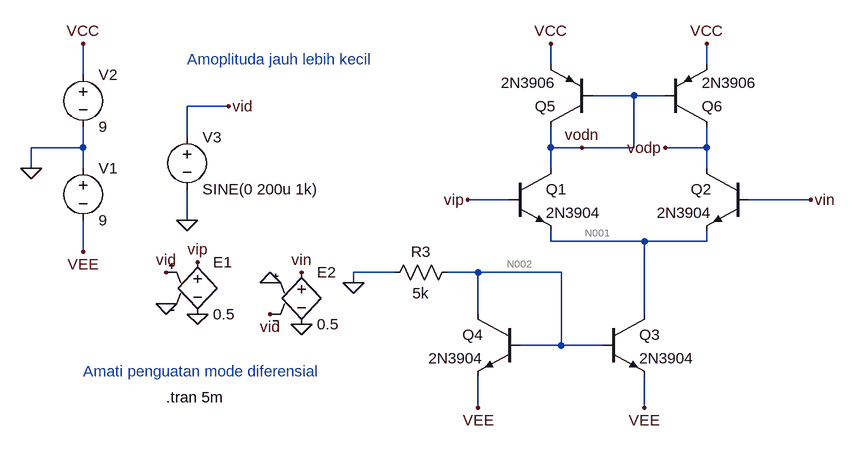
[diagram p0: schematic Perc-01-05-differentialmode.asc]
Perc-01-05-differentialmode.asc, the LTspice schematic file:
Version 4
SHEET 1 880 680
WIRE 400 -48 400 -80
WIRE 640 -48 640 -80
WIRE -320 -32 -320 -80
WIRE 528 0 464 0
WIRE 576 0 528 0
WIRE -96 16 -160 16
WIRE -160 64 -160 16
WIRE -320 80 -320 48
WIRE -320 80 -400 80
WIRE 400 80 400 48
WIRE 448 80 400 80
WIRE 528 80 528 0
WIRE 528 80 448 80
WIRE 640 80 640 48
WIRE 640 80 576 80
WIRE -400 112 -400 80
WIRE -320 112 -320 80
WIRE 400 112 400 80
WIRE 640 112 640 80
WIRE 336 160 272 160
WIRE 800 160 704 160
WIRE -160 192 -160 144
WIRE 400 224 400 208
WIRE 544 224 400 224
WIRE 640 224 640 208
WIRE 640 224 544 224
WIRE -320 240 -320 192
WIRE 160 272 96 272
WIRE 288 272 240 272
WIRE 416 272 288 272
WIRE 96 288 96 272
WIRE 288 336 288 272
WIRE 544 336 544 224
WIRE 416 384 416 272
WIRE 416 384 352 384
WIRE 480 384 416 384
WIRE 288 480 288 432
WIRE 544 480 544 432
FLAG 400 -80 VCC
FLAG 640 -80 VCC
FLAG 448 80 vodn
FLAG 576 80 vodp
FLAG -320 -80 VCC
FLAG -320 240 VEE
FLAG -400 112 0
FLAG -160 192 0
FLAG -96 16 vid
FLAG 96 288 0
FLAG 288 480 VEE
FLAG 544 480 VEE
FLAG 16 352 0
FLAG -144 336 0
FLAG -32 288 0
FLAG -192 320 0
FLAG -192 272 vid
FLAG -32 336 vid
FLAG 272 160 vip
FLAG 800 160 vin
FLAG 16 272 vin
FLAG -144 256 vip
SYMBOL npn 336 112 R0
SYMATTR InstName Q1
SYMATTR Value 2N3904
SYMBOL npn 704 112 M0
SYMATTR InstName Q2
SYMATTR Value 2N3904
SYMBOL voltage -320 96 R0
WINDOW 123 0 0 Left 0
WINDOW 39 0 0 Left 0
SYMATTR InstName V1
SYMATTR Value 9
SYMBOL voltage -320 -48 R0
WINDOW 123 0 0 Left 0
WINDOW 39 0 0 Left 0
SYMATTR InstName V2
SYMATTR Value 9
SYMBOL voltage -160 48 R0
WINDOW 123 0 0 Left 0
WINDOW 39 0 0 Left 0
SYMATTR InstName V3
SYMATTR Value SINE(0 200u 1k)
SYMBOL npn 480 336 R0
SYMATTR InstName Q3
SYMATTR Value 2N3904
SYMBOL npn 352 336 M0
SYMATTR InstName Q4
SYMATTR Value 2N3904
SYMBOL res 256 256 R90
WINDOW 0 0 56 VBottom 2
WINDOW 3 32 56 VTop 2
SYMATTR InstName R3
SYMATTR Value 5k
SYMBOL pnp 464 48 R180
SYMATTR InstName Q5
SYMATTR Value 2N3906
SYMBOL pnp 576 48 M180
SYMATTR InstName Q6
SYMATTR Value 2N3906
SYMBOL e -144 240 R0
SYMATTR InstName E1
SYMATTR Value 0.5
SYMBOL e 16 256 R0
SYMATTR InstName E2
SYMATTR Value 0.5
TEXT -192 464 Left 2 !.tran 5m
TEXT -320 424 Left 2 ;Amati penguatan mode diferensial
TEXT -160 -56 Left 2 ;Amoplituda jauh lebih kecil

The netlist it stands for:
* Perc-01-05-differentialmode.asc
Q1 vodn vip N001 0 2N3904
Q2 vodp vin N001 0 2N3904
V1 0 VEE 9
V2 VCC 0 9
V3 vid 0 SINE(0 200u 1k)
Q3 N001 N002 VEE 0 2N3904
Q4 N002 N002 VEE 0 2N3904
R3 N002 0 5k
Q5 vodn vodn VCC 0 2N3906
Q6 vodp vodn VCC 0 2N3906
E1 vip 0 vid 0 0.5
E2 vin 0 0 vid 0.5
.model NPN NPN
.model PNP PNP
.lib standard.bjt
.tran 5m
* Amati penguatan mode diferensial
* Amoplituda jauh lebih kecil
.backanno
.end

* Results of the author's LTspice run, read from the files saved beside the schematic
* Operating Point, zero values left out:
*   V(vodn) = 8.348 V
*   V(n001) = -650.2 mV
*   V(vodp) = 7.827 V
*   V(vee) = -9 V
*   V(vcc) = 9 V
*   V(n002) = -8.331 V
*   Ic(Q6) = -885.9 µA
*   Ib(Q6) = -4.416 µA
*   Ie(Q6) = 890.3 µA
*   Ic(Q5) = -881.3 µA
*   Ib(Q5) = -4.416 µA
*   Ie(Q5) = 885.7 µA
*   Ic(Q4) = 1.655 mA
*   Ib(Q4) = 5.54 µA
*   Ie(Q4) = -1.661 mA
*   Ic(Q3) = 1.781 mA
*   Ib(Q3) = 5.538 µA
*   Ie(Q3) = -1.787 mA
*   Ic(Q2) = 885.9 µA
*   Ib(Q2) = 2.744 µA
*   Ie(Q2) = -888.6 µA
*   Ic(Q1) = 890.1 µA
*   Ib(Q1) = 2.744 µA
*   Ie(Q1) = -892.9 µA
*   I(R3) = -1.666 mA
*   I(E2) = -2.744 µA
*   I(E1) = -2.744 µA
*   I(V2) = -1.776 mA
*   I(V1) = -3.448 mA
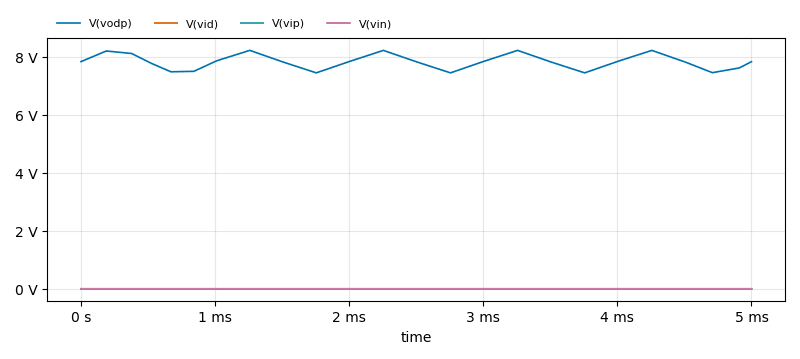
[diagram p1: Transient Analysis of Perc-01-05-differentialmode.asc, plotted from the saved traces]
* Transient Analysis, 1 run:
*   V(vodp): min 7.44 V, max 8.215 V, average 7.824 V, rms 7.829 V, last 7.826 V
*   V(vid): min -193.5 µV, max 193.5 µV, average -1.765 µV, rms 137 µV, last 0 V
*   V(vip): min -96.74 µV, max 96.75 µV, average -882.5 nV, rms 68.48 µV, last 0 V
*   V(vin): min -96.75 µV, max 96.74 µV, average 882.5 nV, rms 68.48 µV, last 0 V